# EAGLE design i-uC (EAGLE 5.07)
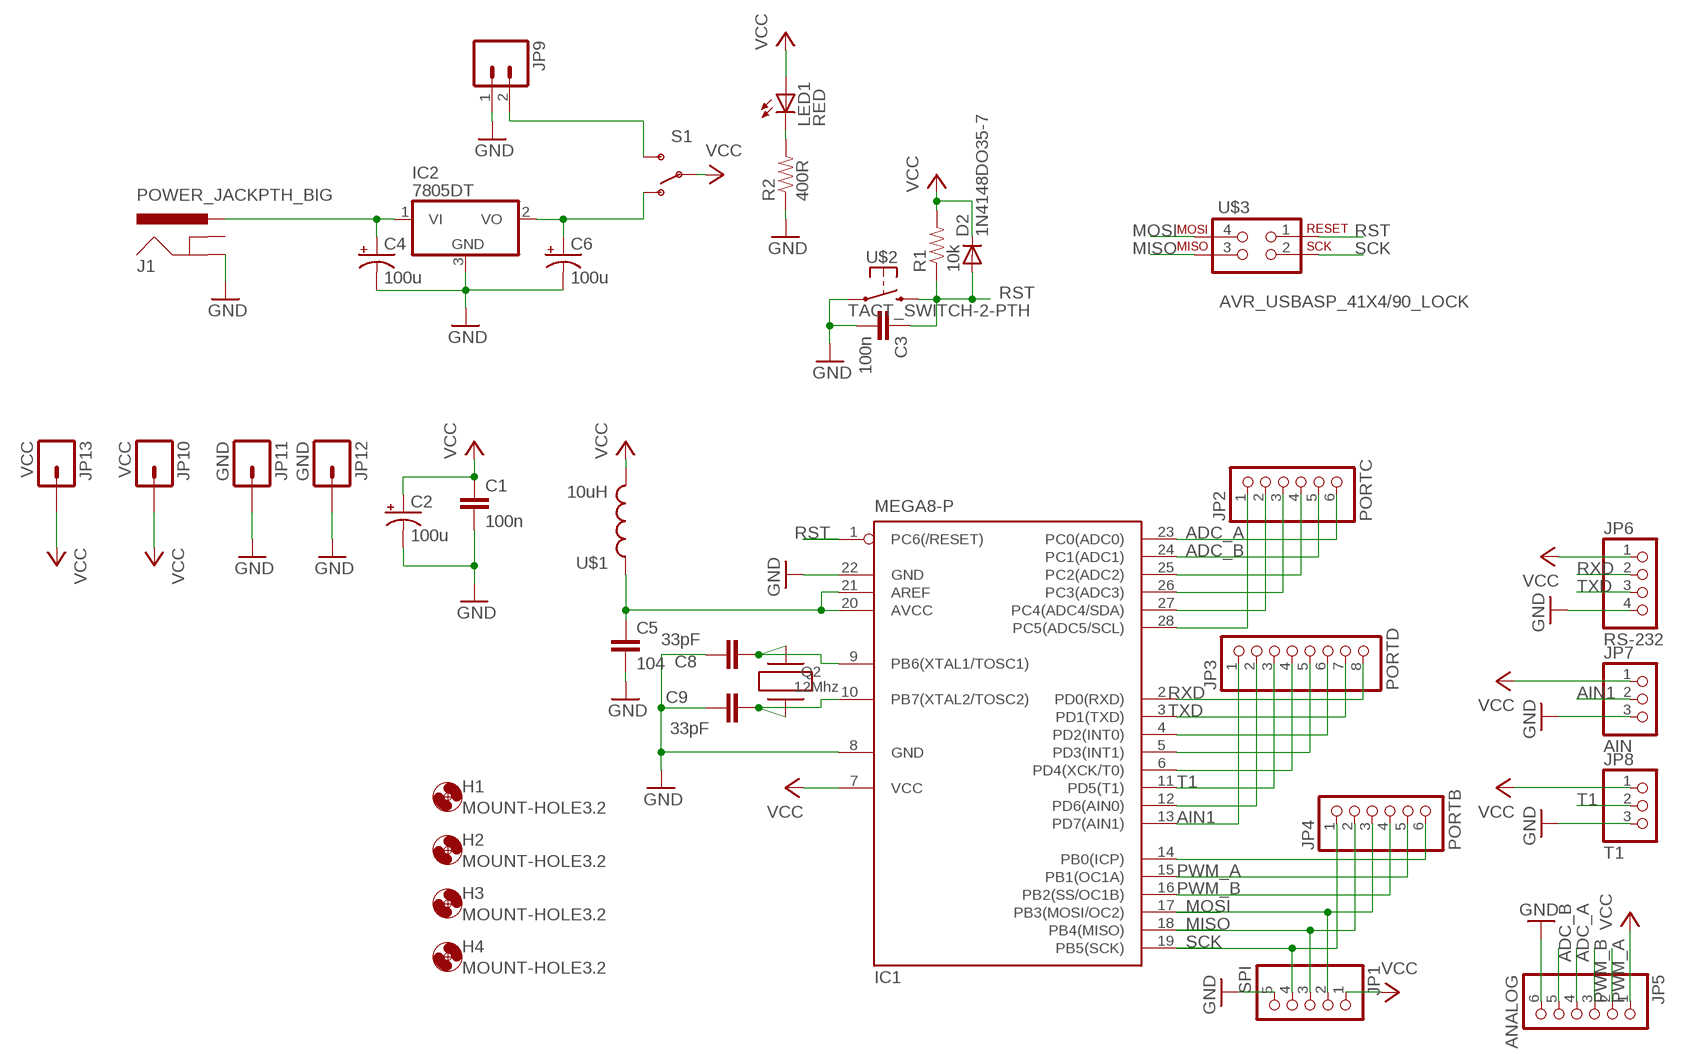
[diagram p0: schematic, sheet 1]

## Parts
C1  100n  CAP0805  [0805]
C2  100u  CAP_POLD  [PANASONIC_D]
C3  100n  CAP-C0805K  [C0805K]
C4  100u  CAP_POLD  [PANASONIC_D]
C5  104  CAP0805  [0805]
C6  100u  CAP_POLD  [PANASONIC_D]
C8  33pF  CAP-C0805K  [C0805K]
C9  33pF  CAP-C0805K  [C0805K]
D2  1N4148DO35-7  DIODE1N4148  [DIODE-1N4148]
H1  MOUNT-HOLE3.2  [3,2]
H2  MOUNT-HOLE3.2  [3,2]
H3  MOUNT-HOLE3.2  [3,2]
H4  MOUNT-HOLE3.2  [3,2]
IC1  MEGA8-P  [DIL28-3]
IC2  7805DT  [TO252]
J1  POWER_JACKPTH_BIG  [POWER_JACK_2.1X5.5_BIG_PTH]
JP1  SPI  PINHD-1X5/90  [1X05/90]
JP2  PORTC  PINHD-1X6  [1X06]
JP3  PORTD  PINHD-1X8  [1X08]
JP4  PORTB  PINHD-1X6  [1X06]
JP5  ANALOG  PINHD-1X6/90  [1X06/90]
JP6  RS-232  PINHD-1X4/90_LOCK  [1X04/90_LOCK]
JP7  AIN  PINHD-1X3/90-LOCK  [1X03/90_LOCK]
JP8  T1  PINHD-1X3/90-LOCK  [1X03/90_LOCK]
JP9  CON-02-XH  [XH-1X2-LONG-LOCK]
JP10  VCC  M01PTH_LONGPAD  [1X01_LONGPAD]
JP11  GND  M01PTH_LONGPAD  [1X01_LONGPAD]
JP12  GND  M01PTH_LONGPAD  [1X01_LONGPAD]
JP13  VCC  M01PTH_LONGPAD  [1X01_LONGPAD]
LED1  RED  LEDCHIP-LED0805  [CHIP-LED0805]
Q2  12Mhz  XTAL  [XTAL]
R1  10k  RESISTOR0805  [0805]
R2  400R  RESISTOR0805  [0805]
S1  SWITCH-SPST3AM6  [SWITCH-SPDT-AM#6]
U$1  10uH  INDUCTOR1/4W-SIZE  [0204/7]
U$2  TACT_SWITCH-2-PTH  [ALPS-SKHV]
U$3  AVR_USBASP_41X4/90_LOCK  [1X04/90_LOCK]

## Nets
ADC_A: IC1.23(PC0(ADC0)) JP2.6 JP5.4
ADC_B: IC1.24(PC1(ADC1)) JP2.5 JP5.5
AIN1: IC1.13(PD7(AIN1)) JP3.1 JP7.2
AVCC: C5.1 IC1.20(AVCC) IC1.21(AREF) U$1.1
GND: C1.2 C2.- C3.2 C4.- C5.2 C6.- C8.2 C9.2 IC1.8(GND) IC1.22(GND) IC2.3(GND) J1.GND JP1.5 JP5.6 JP6.4 JP7.3 JP8.3 JP9.1 JP11.1 JP12.1 R2.1 U$2.2
MISO: IC1.18(PB4(MISO)) JP1.3 JP4.2 U$3.3
MOSI: IC1.17(PB3(MOSI/OC2)) JP1.2 JP4.3 U$3.4
N$1: C6.+ IC2.2(VO) S1.1(O)
N$2: C9.1 IC1.10(PB7(XTAL2/TOSC2)) Q2.1
N$3: JP9.2 S1.3(S)
N$4: LED1.C R2.2
N$5: C4.+ IC2.1(VI) J1.PWR
N$8: IC1.25(PC2(ADC2)) JP2.4
N$9: IC1.26(PC3(ADC3)) JP2.3
N$10: IC1.27(PC4(ADC4/SDA)) JP2.2
N$11: IC1.28(PC5(ADC5/SCL)) JP2.1
N$14: IC1.4(PD2(INT0)) JP3.6
N$15: IC1.5(PD3(INT1)) JP3.5
N$16: IC1.6(PD4(XCK/T0)) JP3.4
N$18: IC1.12(PD6(AIN0)) JP3.2
N$20: IC1.14(PB0(ICP)) JP4.6
N$34: C8.1 IC1.9(PB6(XTAL1/TOSC1)) Q2.2
PWM_A: IC1.15(PB1(OC1A)) JP4.5 JP5.2
PWM_B: IC1.16(PB2(SS/OC1B)) JP4.4 JP5.3
RST: C3.1 D2.A IC1.1(PC6(/RESET)) R1.1 U$2.3 U$3.1
RXD: IC1.2(PD0(RXD)) JP3.8 JP6.2
SCK: IC1.19(PB5(SCK)) JP1.4 JP4.1 U$3.2
T1: IC1.11(PD5(T1)) JP3.3 JP8.2
TXD: IC1.3(PD1(TXD)) JP3.7 JP6.3
VCC: C1.1 C2.+ D2.C IC1.7(VCC) JP1.1 JP5.1 JP6.1 JP7.1 JP8.1 JP10.1 JP13.1 LED1.A R1.2 S1.2(P) U$1.2
Unconnected: J1.GNDBREAK

## Library data of the parts
C1 C5 = SparkFun:CAP: Capacitor Standard 0603 ceramic capacitor, and 0.1" leaded capacitor.
C2 C4 C6 = digital-toy:CAP_POL: Capacitor Polarized These are standard SMD and PTH capacitors. Normally 10uF, 47uF, and 100uF in electrolytic and tantalum varieties. Always verify the external diameter of the through hole cap, it varies with capacity, voltage, and manufacturer. The EIA devices should be standard. PANASONIC_D size: 6.5mmx6.5mmx5.5mm, 100uf (taobao:6.3mmx5.5mm), same as CVL0605 153cvl0405 size: 4mmx4mmx5.5mm, 10uf (taobao:4mmx5.5mm) ct6032 typical 47uF Tantalum, comment by hyl.
C3 C8 C9 = digital-toy:CAP: Capacitor Standard 0603 ceramic capacitor, and 0.1" leaded capacitor.
D2 = digital-toy:DIODE: Diode These are standard reverse protection diodes and small signal diodes. SMA package can handle up to about 1A. SOD-323 can handle about 200mA. What the SOD-323 package when ordering, there are some mfgs out there that are 5-pin packages.
H1-H4 = holes:MOUNT-HOLE: MOUNTING HOLE with drill center marker
IC1 = atmel:MEGA8-P: MICROCONTROLLER 8 Kbytes FLASH, 1 kbytes SRAM, 512 bytes EEPROM, USART, 4-channel 10 bit ADC, 2-channel 8 bit ADC Pin compatible with Atmega48, ATMega88, ATMega168 Source: avr.lbr
IC2 = linear:78*: Positive VOLTAGE REGULATOR Source: http://cache.national.com/ds/LM/LM78L05.pdf http://www.fairchildsemi.com/ds/LM/LM7805.pdf
J1 = digital-toy:POWER_JACK: Power Jack This is the standard 5.5mm barrel jack for power. The PTH is the most common, proven, reliable, footprint. All others are experimental. The Slot footprint only works if the mill layer is transmitted to the PCB fab house so be warned. Spark Fun Electronics SKU : PRT-00119. Mating wall wart : TOL-00298 (and others)
JP1 = pinhead:PINHD-1X5: PIN HEADER
JP2 JP4 JP5 = pinhead:PINHD-1X6: PIN HEADER
JP3 = pinhead:PINHD-1X8: PIN HEADER
JP6 = digital-toy:PINHD-1X4: PIN HEADER
JP7 JP8 = digital-toy:PINHD-1X3: PIN HEADER
JP9 = digital-toy:CON-02: Header 2 Standard 2-pin 0.1" header. Use with straight break away headers (SKU : PRT-00116), right angle break away headers (PRT-00553), swiss pins (PRT-00743), machine pins (PRT-00117), and female headers (PRT-00115). Molex polarized connector foot print use with SKU : PRT-08233 with associated crimp pins and housings.
JP10-JP13 = SparkFun:M01: Header 1 Standard 1-pin 0.1" header. Use with straight break away headers (SKU : PRT-00116), right angle break away headers (PRT-00553), swiss pins (PRT-00743), machine pins (PRT-00117), and female headers (PRT-00115).
LED1 = led:LED: LED OSRAM: - CHIPLED LG R971, LG N971, LY N971, LG Q971, LY Q971, LO R971, LY R971 LH N974, LH R974 LS Q976, LO Q976, LY Q976 LO Q996 - Hyper CHIPLED LW Q18S LB Q993, LB Q99A, LB R99A - SideLED LS A670, LO A670, LY A670, LG A670, LP A670 LB A673, LV A673, LT A673, LW A673 LH A674 LY A675 LS A676, LA A676, LO A676, LY A676, LW A676 LS A679, LY A679, LG A679 - Hyper Micro SIDELED® LS Y876, LA Y876, LO Y876, LY Y876 LT Y87S - SmartLED LW L88C, LW L88S LB L89C, LB L89S, LG L890 LS L89K, LO L89K, LY L89K LS L896, LA L896, LO L896, LY L896 - TOPLED LS T670, LO T670, LY T670, LG T670, LP T670 LSG T670, LSP T670, LSY T670, LOP T670, LYG T670 LG T671, LOG T671, LSG T671 LB T673, LV T673, LT T673, LW T673 LH T674 LS T676, LA T676, LO T676, LY T676, LB T676, LH T676, LSB T676, LW T676 LB T67C, LV T67C, LT T67C, LS T67K, LO T67K, LY T67K, LW E67C LS E67B, LA E67B, LO E67B, LY E67B, LB E67C, LV E67C, LT E67C LW T67C LS T679, LY T679, LG T679 LS T770, LO T770, LY T770, LG T770, LP T770 LB T773, LV T773, LT T773, LW T773 LH T774 LS E675, LA E675, LY E675, LS T675 LS T776, LA T776, LO T776, LY T776, LB T776 LHGB T686 LT T68C, LB T68C - Hyper Mini TOPLED® LB M676 - Mini TOPLED Santana® LG M470 LS M47K, LO M47K, LY M47K Source: http://www.osram.convergy.de LUXEON: - LUMILED® LXK2-PW12-R00, LXK2-PW12-S00, LXK2-PW14-U00, LXK2-PW14-V00 LXK2-PM12-R00, LXK2-PM12-S00, LXK2-PM14-U00 LXK2-PE12-Q00, LXK2-PE12-R00, LXK2-PE12-S00, LXK2-PE14-T00, LXK2-PE14-U00 LXK2-PB12-K00, LXK2-PB12-L00, LXK2-PB12-M00, LXK2-PB14-N00, LXK2-PB14-P00, LXK2-PB14-Q00 LXK2-PR12-L00, LXK2-PR12-M00, LXK2-PR14-Q00, LXK2-PR14-R00 LXK2-PD12-Q00, LXK2-PD12-R00, LXK2-PD12-S00 LXK2-PH12-R00, LXK2-PH12-S00 LXK2-PL12-P00, LXK2-PL12-Q00, LXK2-PL12-R00 Source: www.luxeon.com KINGBRIGHT: KA-3528ASYC Source: www.kingbright.com
Q2 = yhf_spec-RF:XTAL
R1 R2 = digital-toy:RESISTOR: Resistor Basic schematic elements and footprints for 0603, 1206, and PTH 1/10th watt (small) resistors. digital-toy copy vertical mount of axial-0.3 from rcl.lbr : the 0207/xx
S1 = digital-toy:SWITCH-SPST: SPST Switch Simple slide switch. Spark Fun Electronics SKU : COM-00102
U$1 = digital-toy:INDUCTOR: Inductors Basic Inductor/Choke - 0603 and 1206. Footprints are not proven and vary greatly between part numbers.
U$2 = digital-toy:TACT_SWITCH-2
U$3 = digital-toy:AVR_USBASP_4: AVR ISP 6 Pin This is the reduced ISP connector for AVR programming. Common on Arduino. This footprint will take up less PCB space and can be used with a 10-pin to 6-pin adapter such as SKU: BOB-08508

## Board
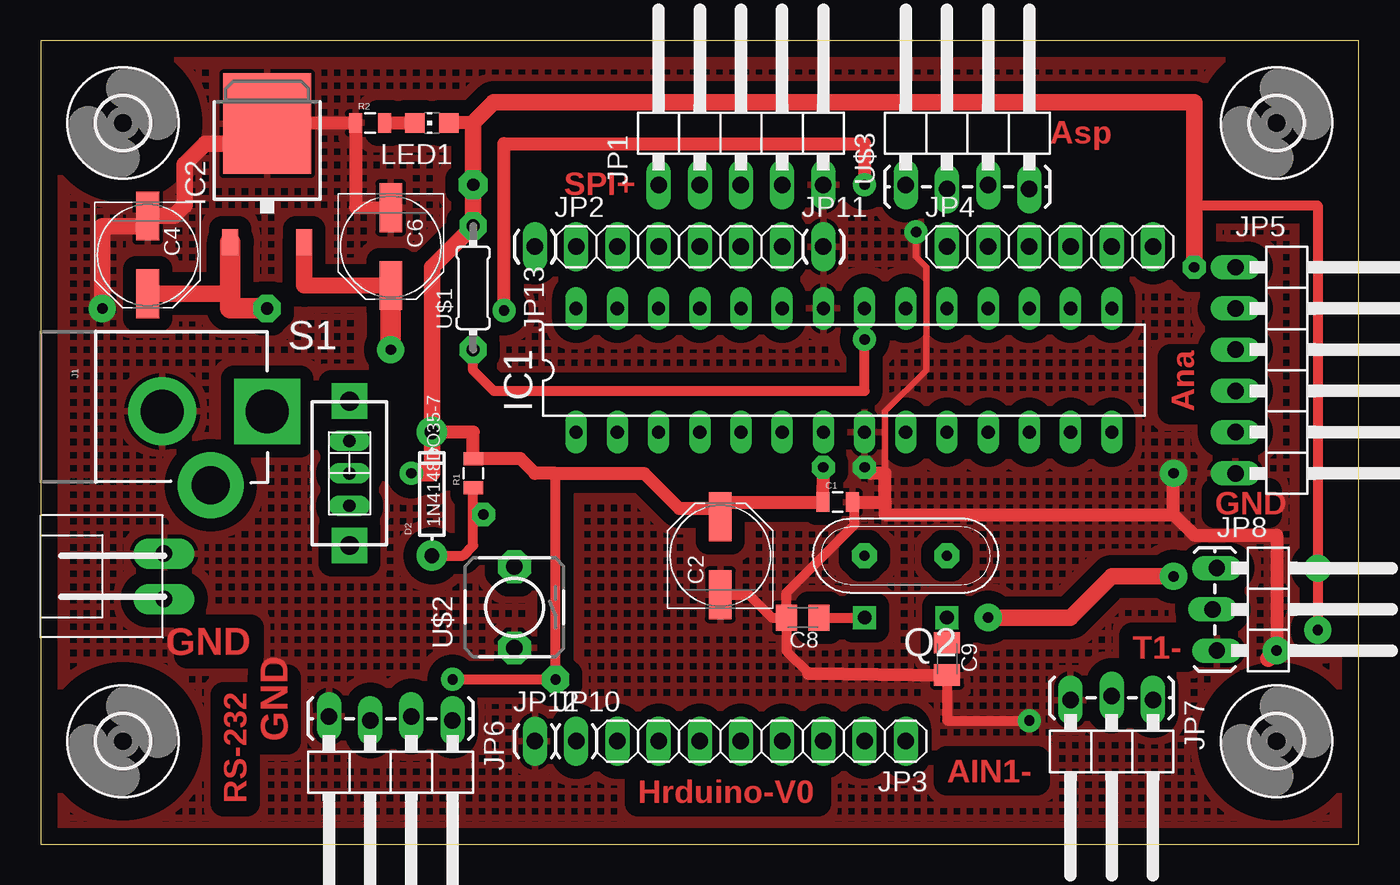
[diagram p1: board, top side]
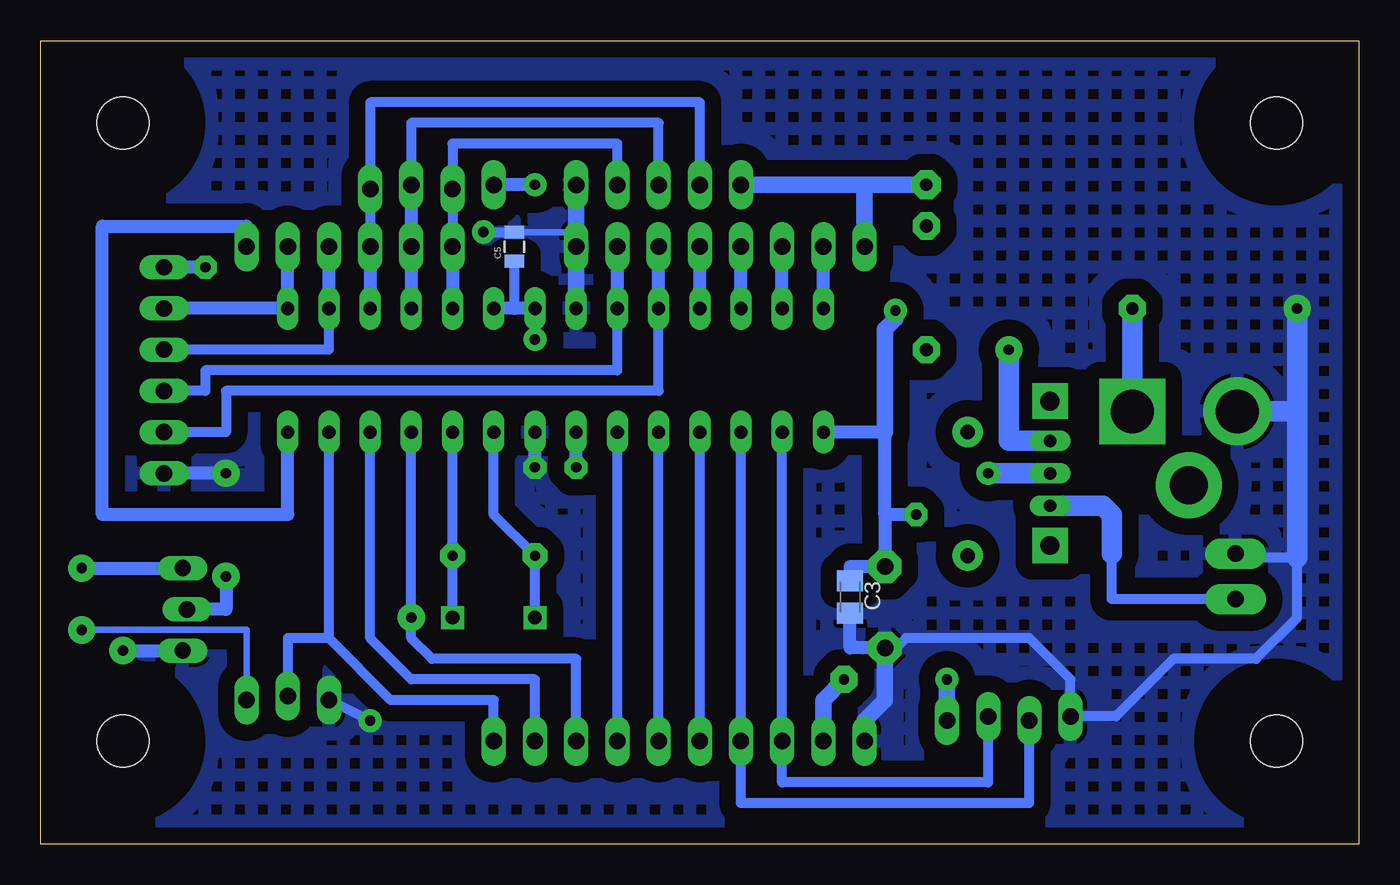
[diagram p2: board, bottom side, seen from below]

Size 81.28 x 49.53 mm. Coordinates in mm from the lower left corner, seen from the top.
Outline: 0,0 81.28,0 81.28,49.53 0,49.53 0,0
Copper layers (1*16): Top 0.035mm / dielectric 1.5mm / Bottom 0.035mm
Design rules "default": minimum track width 10mil, minimum drill 24mil, track to track 8mil, track to pad 8mil, pad to pad 8mil, via to via 8mil, smd to smd 8mil, copper to edge 40mil, drill to drill 8mil, minimum pad ring 10mil, minimum via ring 8mil, stop-mask expansion 4mil, vias tented up to drill 0mil, thermal gap 10mil

### Footprints (pad centres in the part's own frame; a part is rotated, then mirrored left to right if it is on the bottom)
0805 = smd 0.8 x 1.2: 1 -0.9,0; 2 0.9,0
PANASONIC_D = smd 3 x 1.4: + 2.4,0; - -2.4,0
C0805K = smd 1.3 x 1.6: 1 -1,0; 2 1,0
DIODE-1N4148 = drill 0.9 pad 1.88 round: A -3.81,0; C 3.81,0
3,2 = hole 3.2: 0,0
DIL28-3 = drill 0.813 long: 1 -16.51,-3.81; 2 -13.97,-3.81; 3 -11.43,-3.81; 4 -8.89,-3.81; 5 -6.35,-3.81; 6 -3.81,-3.81; 7 -1.27,-3.81; 8 1.27,-3.81; 9 3.81,-3.81; 10 6.35,-3.81; 11 8.89,-3.81; 12 11.43,-3.81; 13 13.97,-3.81; 14 16.51,-3.81; 15 16.51,3.81; 16 13.97,3.81; 17 11.43,3.81; 18 8.89,3.81; 19 6.35,3.81; 20 3.81,3.81; 21 1.27,3.81; 22 -1.27,3.81; 23 -3.81,3.81; 24 -6.35,3.81; 25 -8.89,3.81; 26 -11.43,3.81; 27 -13.97,3.81; 28 -16.51,3.81
TO252 = smd 1 x 1.6: 1 -2.28,-4.8; 2 2.28,-4.8 | smd 5.4 x 6.2: 3 0,2.5
POWER_JACK_2.1X5.5_BIG_PTH = drill 2.667 pad 4.191 round: GND 0,-0.127 | drill 2.337 pad 4.064 round: GNDBREAK 4.547,2.87 | drill 2.667 pad 4.064 square: PWR 0,6.35
1X05/90 = drill 1.016 long: 1 -5.08,-3.81; 2 -2.54,-3.81; 3 0,-3.81; 4 2.54,-3.81; 5 5.08,-3.81
1X06 = drill 1.016 long: 1 -6.35,0; 2 -3.81,0; 3 -1.27,0; 4 1.27,0; 5 3.81,0; 6 6.35,0
1X08 = drill 1.016 long: 1 -8.89,0; 2 -6.35,0; 3 -3.81,0; 4 -1.27,0; 5 1.27,0; 6 3.81,0; 7 6.35,0; 8 8.89,0
1X06/90 = drill 1.016 long: 1 -6.35,-3.81; 2 -3.81,-3.81; 3 -1.27,-3.81; 4 1.27,-3.81; 5 3.81,-3.81; 6 6.35,-3.81
1X04/90_LOCK = drill 1.016 long: 1 -3.81,-3.81; 2 -1.27,-4.064; 3 1.27,-3.81; 4 3.81,-4.064
1X03/90_LOCK = drill 1.016 long: 1 -2.54,-3.81; 2 0,-4.064; 3 2.54,-3.81
XH-1X2-LONG-LOCK = drill 1.016 pad 1.88 long: 1 1.397,0; 2 -1.397,0
1X01_LONGPAD = drill 1.016 long: 1 0,0
CHIP-LED0805 = smd 1.2 x 1.2: A 0,-1.05; C 0,1.05
XTAL = drill 0.61 pad 1.524 octagon: 1 -2.54,0; 2 2.54,0
SWITCH-SPDT-AM#6 = drill 0.762 pad 1.27 long: 1 0,2; 2 0,0; 3 0,-2 | drill 1.15 pad 2.184 square: P$1 0,-4.445; P$2 0,4.445
0204/7 = drill 0.813 pad 1.676 octagon: 1 -3.81,0; 2 3.81,0
ALPS-SKHV = drill 1.016 pad 2.032 octagon: 2 -2.51,0; 3 2.51,0

### Placement (x,y rotation side)
C1  49.15,21.08 0 top
C2  41.91,17.78 90 top
C3  31.37,15.24 270 bottom
C4  6.6,36.32 270 top
C5  52.07,36.83 90 bottom
C6  21.59,36.83 270 top
C8  46.99,13.97 180 top
C9  55.88,11.43 270 top
D2  24.13,21.59 90 top
H1  5.08,44.45 0 top
H2  76.2,44.45 0 top
H3  76.2,6.35 0 top
H4  5.08,6.35 0 top
IC1  49.53,29.21 0 top
IC2  13.97,41.91 0 top
J1  7.62,26.67 270 top
JP1  43.18,44.45 0 top
JP2  39.37,36.83 0 top
JP3  44.45,6.35 180 top
JP4  62.23,36.83 0 top
JP5  77.47,29.21 270 top
JP6  21.59,3.81 180 top
JP7  66.04,5.08 180 top
JP8  76.33,14.48 270 top
JP9  7.62,16.51 90 top
JP10  33.02,6.35 0 top
JP11  48.26,36.83 0 top
JP12  30.48,6.35 0 top
JP13  30.48,36.83 0 top
LED1  24.13,44.45 90 top
Q2  53.34,17.78 180 top
R1  26.67,22.86 90 top
R2  20.32,44.45 0 top
S1  19.05,22.86 0 top
U$1  26.67,34.29 90 top
U$2  29.21,14.61 90 top
U$3  57.15,44.45 0 top

### Tracks (layer width: path | path; a pad name or v marks a point on that pad's centre or on a via)
ADC_A
  Bottom 0.61: IC1.23 45.72,29.21 71.12,29.21 71.12,27.94 JP5.4
  Bottom 0.813: IC1.23 JP2.6
ADC_B
  Bottom 0.61: IC1.24 43.18,27.94 69.85,27.94 69.85,25.4 JP5.5
  Bottom 0.813: IC1.24 JP2.5
AIN1
  Bottom 0.61: JP3.1 53.34,8.89 59.69,8.89 63.5,12.7 | 63.5,12.7 IC1.13 | JP7.2 66.04,12.7 63.5,12.7
AVCC  (via drill 0.64 pad 1.42)
  Top 0.61: v50.8,31.11 50.8,27.94 27.94,27.94 26.67,29.21 U$1.1
  Bottom 0.61: v50.8,31.11 IC1.21 | 52.07,33.02 C5.1
  Bottom 0.813: IC1.21 52.07,33.02 IC1.20
GND  (via drill 0.64 pad 1.42, 0.64 pad 1.68)
  Top 0.406: 52.07,22.86 52.07,26.67 54.61,29.21 54.61,35.56 53.98,36.2 v53.98,37.73
  Top 0.61: IC2.3 12.7,45.35 | 51.17,22.86 v50.8,23.23 | v60.96,7.62 55.88,7.62 C9.2 | 6.6,38.1 C4.- | 47.36,10.53 45.99,11.9 C8.2 | C8.2 45.99,15.51 50.16,19.68 50.16,20.97 C1.2 | C2.- 43.67,15.38 45.09,13.97 C8.2 | U$2.2 29.24,12.06
  Top 0.813: 51.17,22.86 52.07,22.86 52.07,21.08 | 47.36,10.53 C9.2 | 69.85,20.32 v69.85,22.86 | 69.85,20.32 52.07,20.32 52.07,21.08 | C1.2 52.07,21.08 | 12.7,45.35 12.7,44.45 | v76.2,11.94 76.2,19.05 71.12,19.05 69.85,20.32 | IC2.3 13.97,44.45 R2.1 19.42,39.24 C6.-
  Top 1.016: v76.2,11.94 75.69,11.43 | v3.81,33.02 3.81,38.1 6.6,38.1 | C4.- 8.24,38.72 8.89,39.37 8.89,41.91 10.16,43.18 12.74,43.18 IC2.3
  Bottom 0.406: C5.2 48.63,37.73 48.26,38.1
  Bottom 0.61: v60.96,7.62 JP7.3 | v53.98,37.73 C5.2 | JP9.1 7.62,17.65 3.81,17.65 3.81,13.97 6.35,11.43 11.43,11.43 14.99,7.87 JP6.4 17.78,10.16 20.32,12.7 27.94,12.7 29.21,11.43
  Bottom 0.813: v50.8,23.23 IC1.8 | v69.85,22.86 JP5.6 | U$2.2 31.37,12.1 C3.2 | v76.2,11.94 JP8.3 | JP6.4 17.78,7.62
  Bottom 1.016: JP1.5 48.26,38.1 JP11.1 IC1.22 | JP12.1 30.48,7.62 29.21,8.89 29.21,11.43 U$2.2
  Bottom 1.27: 3.81,26.67 J1.GND | 3.81,17.65 3.81,26.67 | 3.81,26.67 v3.81,33.02
  pour Top (isolate 0.813, hatched): 8.89,60.96 91.44,57.15 104.14,43.18 105.41,11.43 96.52,-11.43 6.35,-12.7 -11.43,5.08 -12.7,52.07
  pour Bottom (isolate 1.016, hatched): 86.36,58.42 90.17,19.05 96.52,10.16 78.74,-7.62 3.81,-7.62 -9.53,6.35 -8.26,53.34
MISO
  Bottom 0.61: JP1.3 43.18,44.45 58.42,44.45 U$3.3
  Bottom 0.813: IC1.18 JP4.2 U$3.3
MOSI
  Bottom 0.61: JP1.2 40.64,45.72 60.96,45.72 U$3.4 JP4.3
  Bottom 0.813: JP4.3 IC1.17
N$1  (via drill 0.64 pad 1.68)
  Top 1.016: IC2.2 16.26,34.44 C6.+
  Top 1.27: v21.59,30.48 C6.+
  Bottom 1.27: S1.1 21.59,24.86 v21.59,30.48
N$2  (via drill 0.84 pad 1.42)
  Top 0.61: C9.1 v55.88,13.97
  Bottom 0.61: IC1.10 Q2.1 v55.88,13.97
N$3
  Bottom 0.61: JP9.2 15.24,15.11 15.24,17.91
  Bottom 1.27: 15.24,17.91 15.24,20.32 15.78,20.86 S1.3
N$4
  Top 0.813: R2.2 LED1.C
N$5  (via drill 0.76 pad 1.68)
  Top 0.61: 11.69,34.29 11.32,33.92
  Top 1.016: 11.32,33.92 C4.+
  Top 1.27: v13.97,33.02 11.68,33.05 11.69,34.29 IC2.1
  Bottom 1.27: J1.PWR v13.97,33.02
N$8
  Bottom 0.813: IC1.25 JP2.4
N$9
  Bottom 0.813: IC1.26 JP2.3
N$10
  Bottom 0.813: IC1.27 JP2.2
N$11
  Bottom 0.813: IC1.28 JP2.1
N$14
  Bottom 0.61: JP3.6 IC1.4
N$15
  Bottom 0.61: JP3.5 IC1.5
N$16
  Bottom 0.61: JP3.4 IC1.6
N$18
  Bottom 0.61: JP3.2 50.8,10.16 58.42,10.16 60.96,12.7 IC1.12
N$20
  Bottom 0.813: IC1.14 66.04,20.32 77.47,20.32 77.47,38.1 68.58,38.1 JP4.6
N$34  (via drill 0.84 pad 1.42)
  Top 0.61: C8.1 v50.8,13.97
  Bottom 0.61: IC1.9 53.34,20.32 Q2.2 v50.8,13.97
PWM_A
  Bottom 0.813: JP5.2 IC1.15 JP4.5
PWM_B
  Bottom 0.61: IC1.16 63.5,30.48 JP5.3
  Bottom 0.813: IC1.16 JP4.4
RST  (via drill 0.64 pad 1.42)
  Top 0.61: 26.67,20.32 v27.3,20.32 | 26.67,20.32 R1.1 | 26.67,20.32 26.67,18.41 26.04,17.78 D2.A
  Top 0.813: v28.57,32.89 28.57,43.18 50.8,43.18 v50.8,40.64
  Bottom 0.813: v50.8,40.64 U$3.1 | 29.21,20.32 U$2.3 31.37,17.11 C3.1 | 29.21,20.32 29.21,25.4 IC1.1 | v27.3,20.32 29.21,20.32
  Bottom 1.016: v28.57,32.89 28.57,32.38 29.21,31.75 29.21,25.4
RXD
  Bottom 0.61: IC1.2 JP3.8 35.56,3.81 22.86,3.81 JP6.2
SCK
  Bottom 0.61: JP1.4 45.72,43.18 55.88,43.18 U$3.2 JP4.1
  Bottom 0.813: JP4.1 IC1.19
T1  (via drill 0.64 pad 1.68)
  Top 1.016: v58.42,13.97 63.5,13.97 66.04,16.51 v69.85,16.51
  Bottom 0.61: JP3.3 48.26,11.43 57.15,11.43 58.42,12.7 v58.42,13.97 IC1.11
  Bottom 0.813: JP8.2 69.85,14.48 v69.85,16.51
TXD
  Bottom 0.61: IC1.3 JP3.7 38.1,2.54 20.32,2.54 JP6.3
VCC  (via drill 0.64 pad 1.42, 0.64 pad 1.68, 0.76 pad 1.78)
  Top 0.254: 41.78,21.08 C2.+ 41.91,20.7
  Top 0.61: 39.37,20.7 39.24,20.7 | 31.75,22.86 v31.75,10.16 v25.4,10.16 | v78.74,13.21 v78.74,17.02 78.74,39.37 71.12,39.37
  Top 0.813: 41.78,21.08 C1.1 v48.26,23.23 | 41.91,20.7 39.37,20.7 37.21,22.86 31.75,22.86 30.48,22.86 29.58,23.76 R1.2 26.67,25.4 D2.C | 26.67,44.45 LED1.A
  Top 1.016: v71.12,35.56 71.12,39.37 71.12,45.72 27.94,45.72 26.67,44.45 v26.67,40.64 U$1.2 24.13,35.56 D2.C 24.13,22.86 v22.86,22.86
  Bottom 0.406: JP7.1 68.58,13.21 v78.74,13.21
  Bottom 0.813: v48.26,23.23 IC1.7 | v71.12,35.56 JP5.1 | v78.74,17.02 JP8.1
  Bottom 1.016: v26.67,40.64 30.48,40.64 | 30.48,40.64 JP1.1 | JP10.1 33.02,8.89 v31.75,10.16 | JP6.1 v25.4,10.16 | 30.48,40.64 JP13.1
  Bottom 1.27: v22.86,22.86 S1.2

### Text on the board
Top: Asp | SPI+ | Ana | GND | GND | T1- | GND | AIN1- | RS-232 | Hrduino-V0
Document: AREF | GND | PB5 | PB4 | PB3 | PB2 | PB1 | PB0 | PD7 | PD6 | PD5 | PD4 | PD3 | PD2 | PD1 | PD0 | !Reset | +3V3 | +5V | GND | GND | +Vin | PC0 | PC1 | PC2 | PC3 | PC4 | PC5